# EAGLE schematic Bodenplatine (EAGLE 8.6.0)
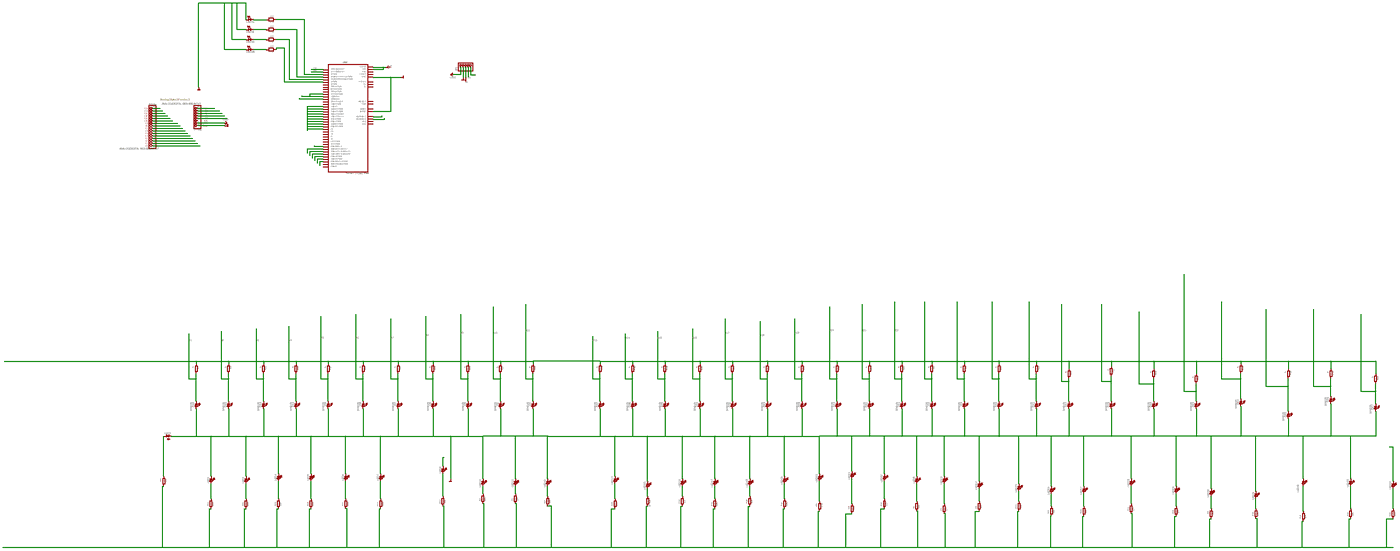
[diagram p0: schematic, sheet 1, overview]
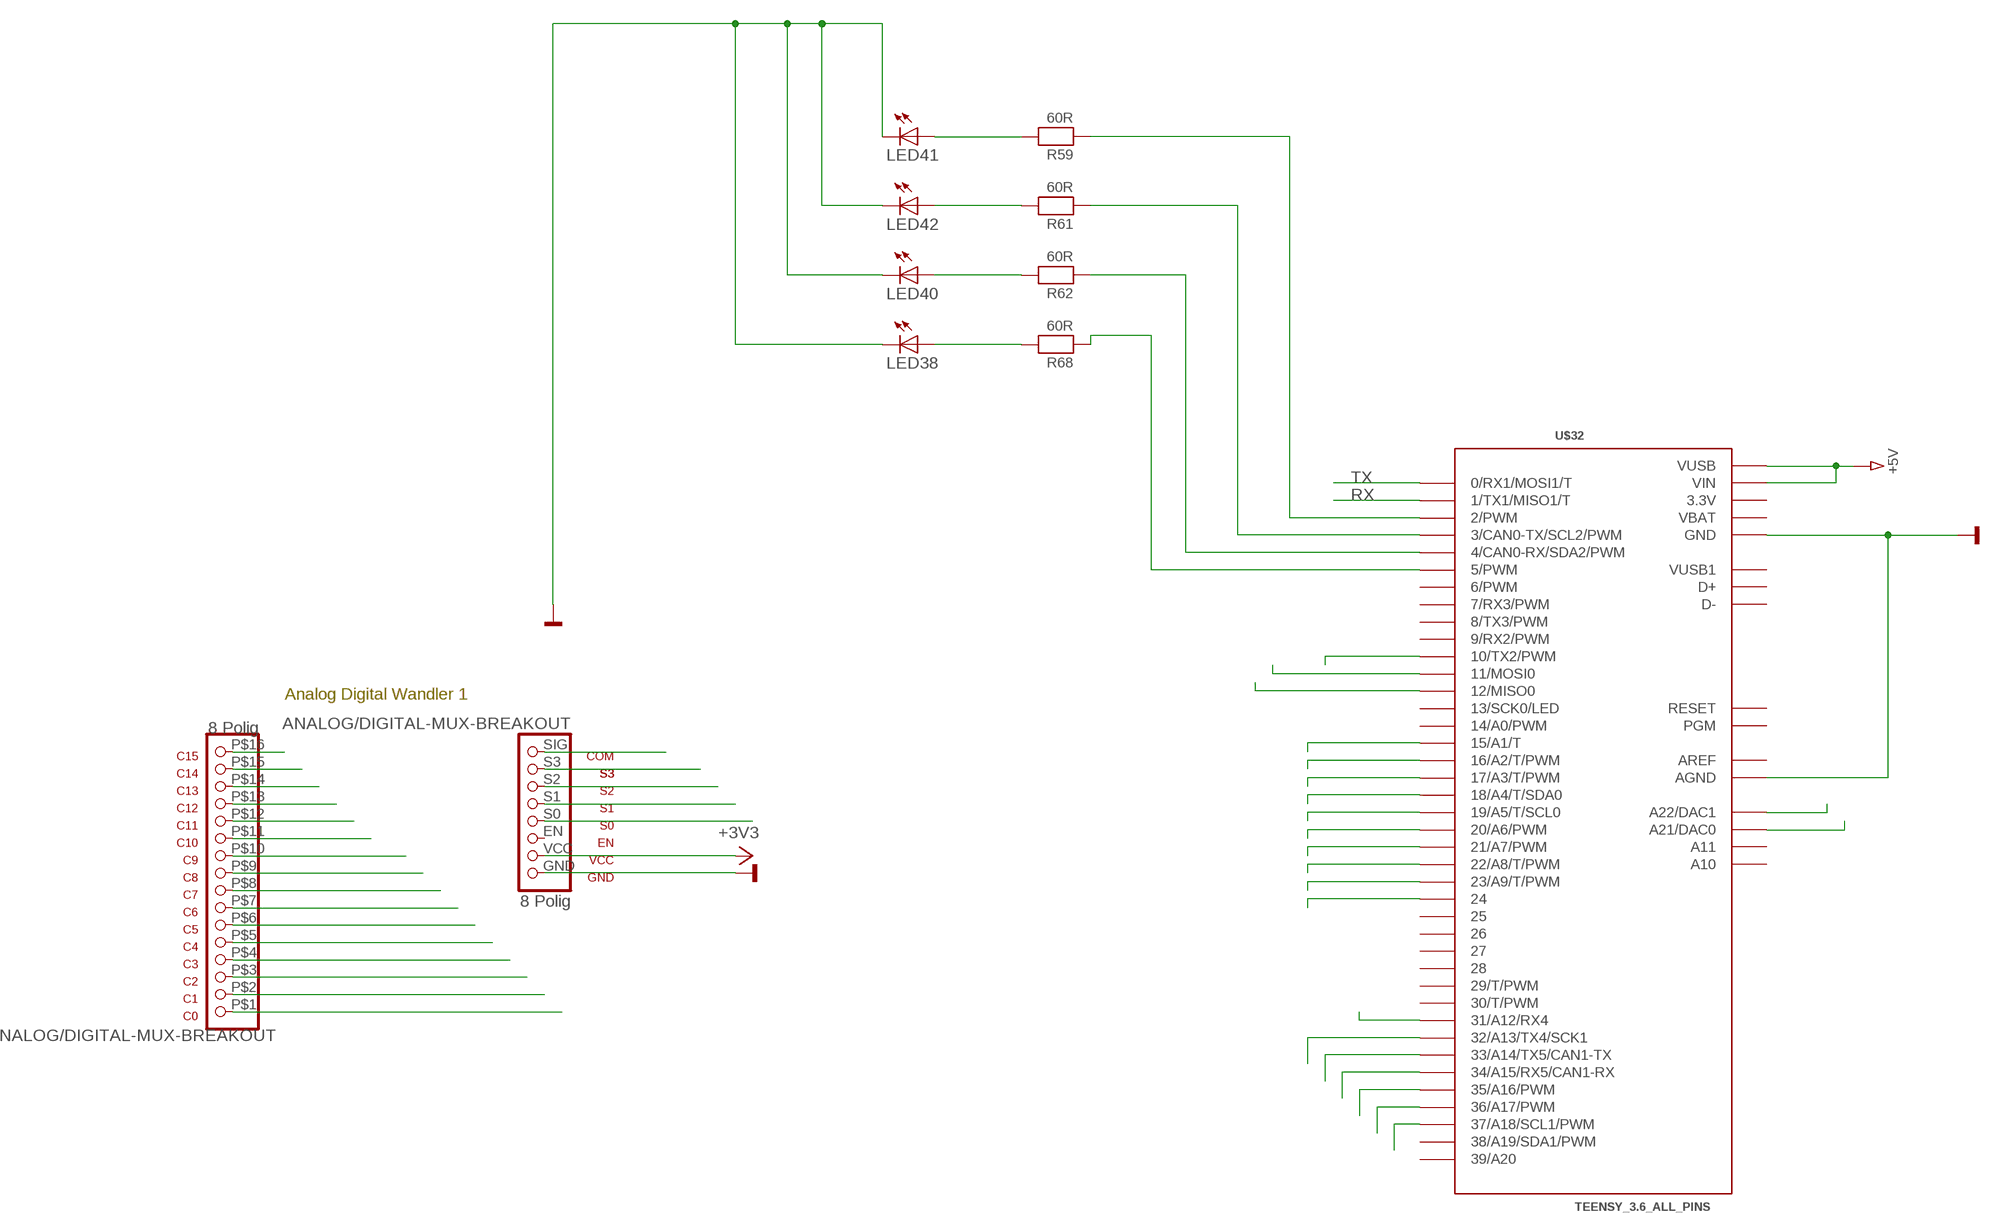
[diagram p1: schematic, sheet 1, part 1 of 6]
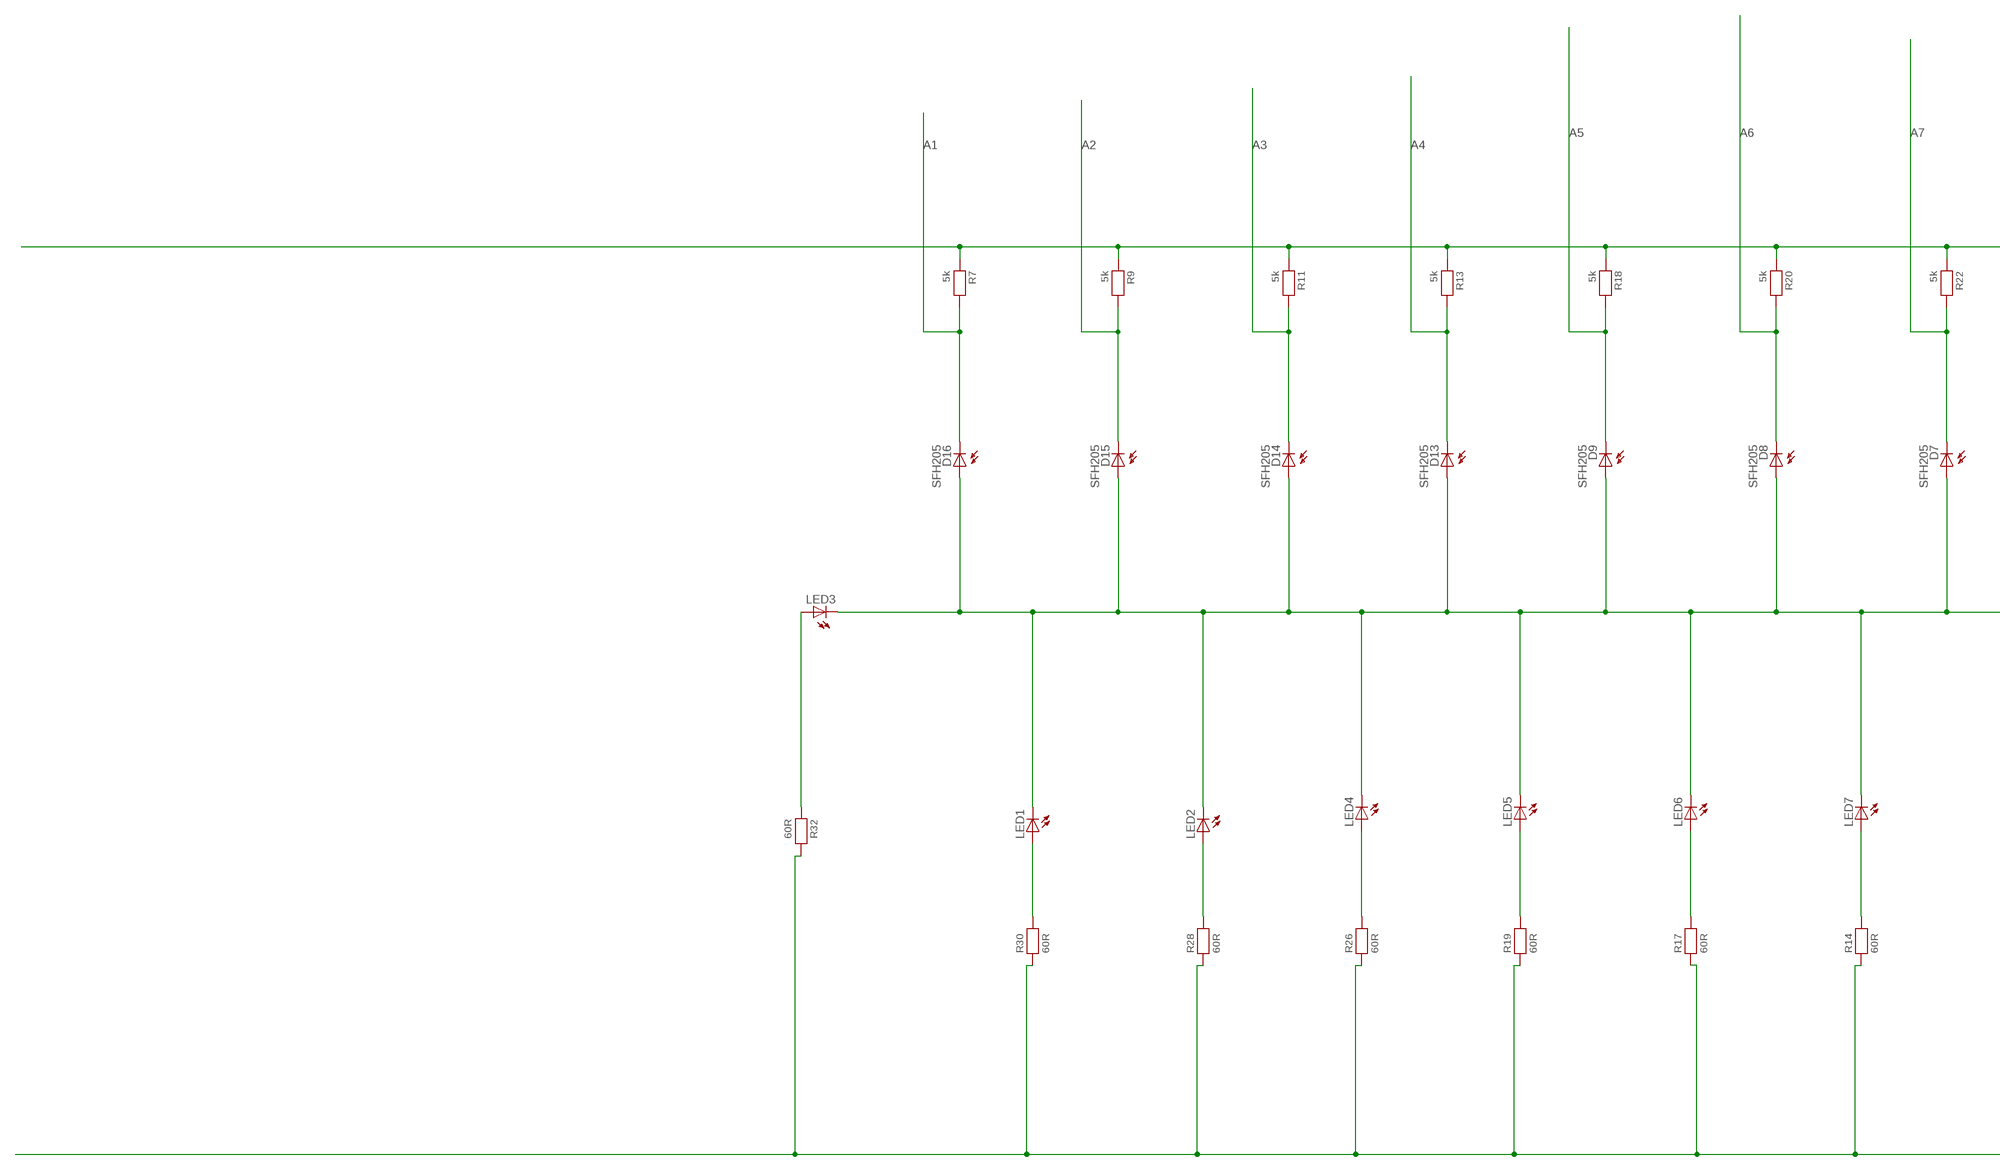
[diagram p2: schematic, sheet 1, part 2 of 6]
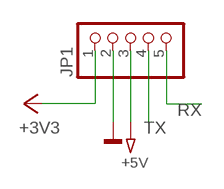
[diagram p3: schematic, sheet 1, part 3 of 6]
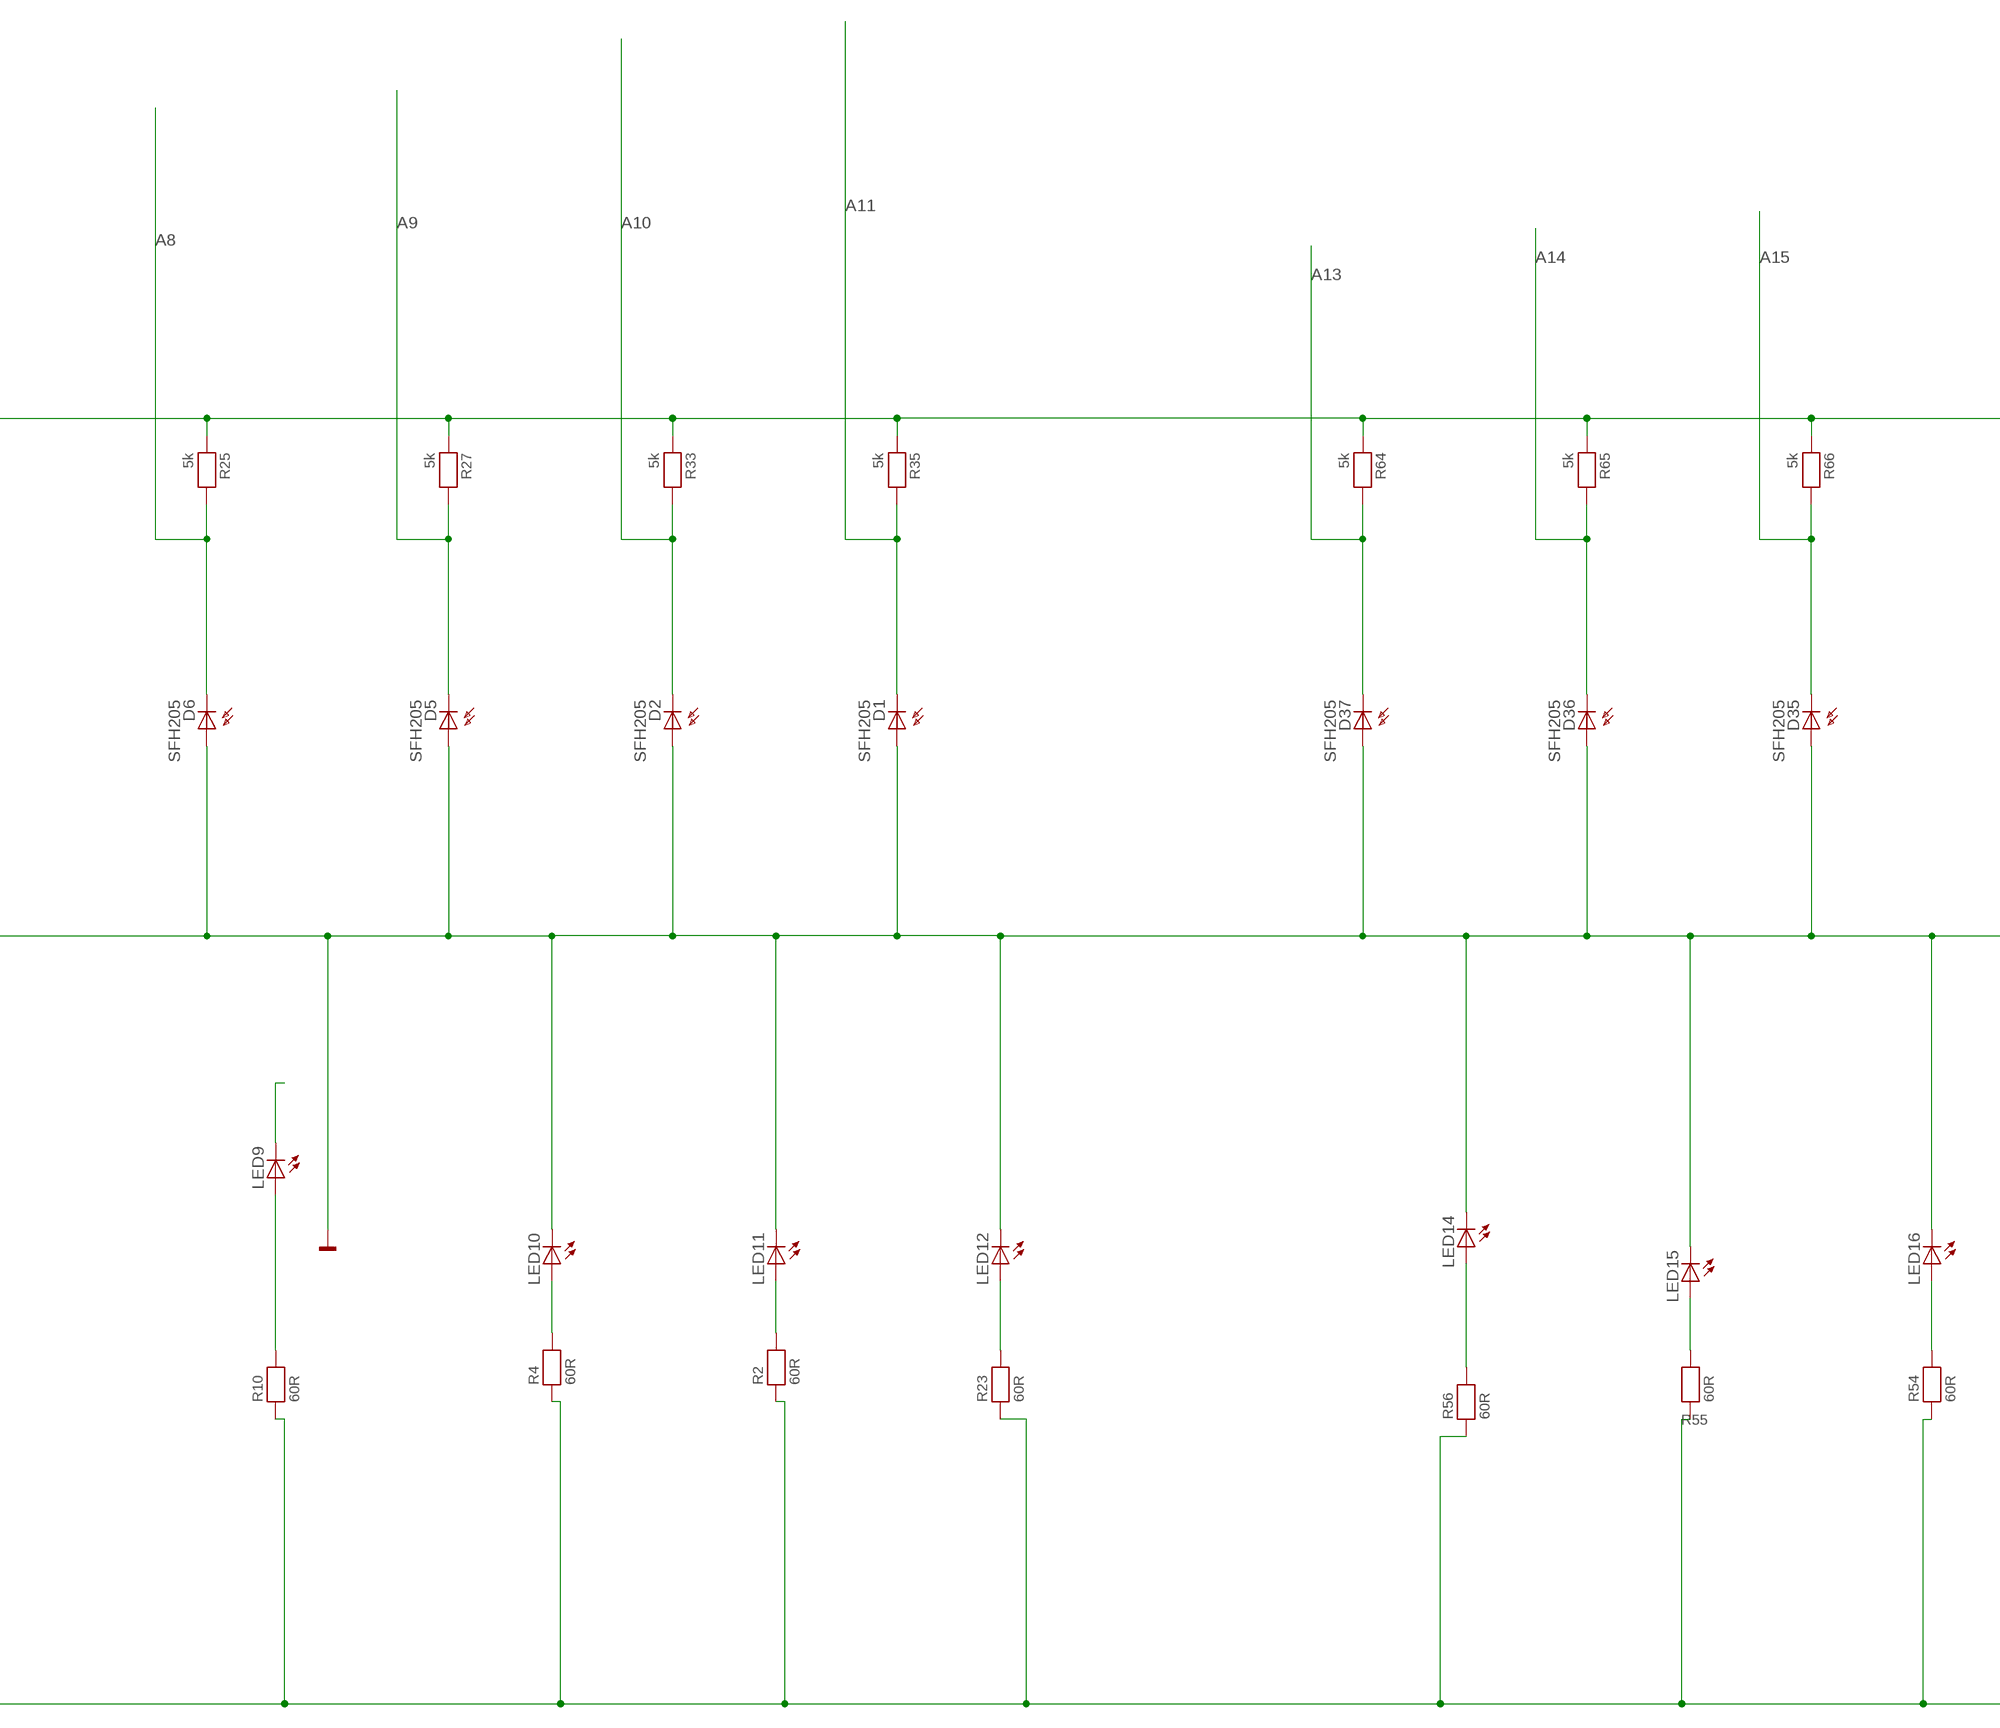
[diagram p4: schematic, sheet 1, part 4 of 6]
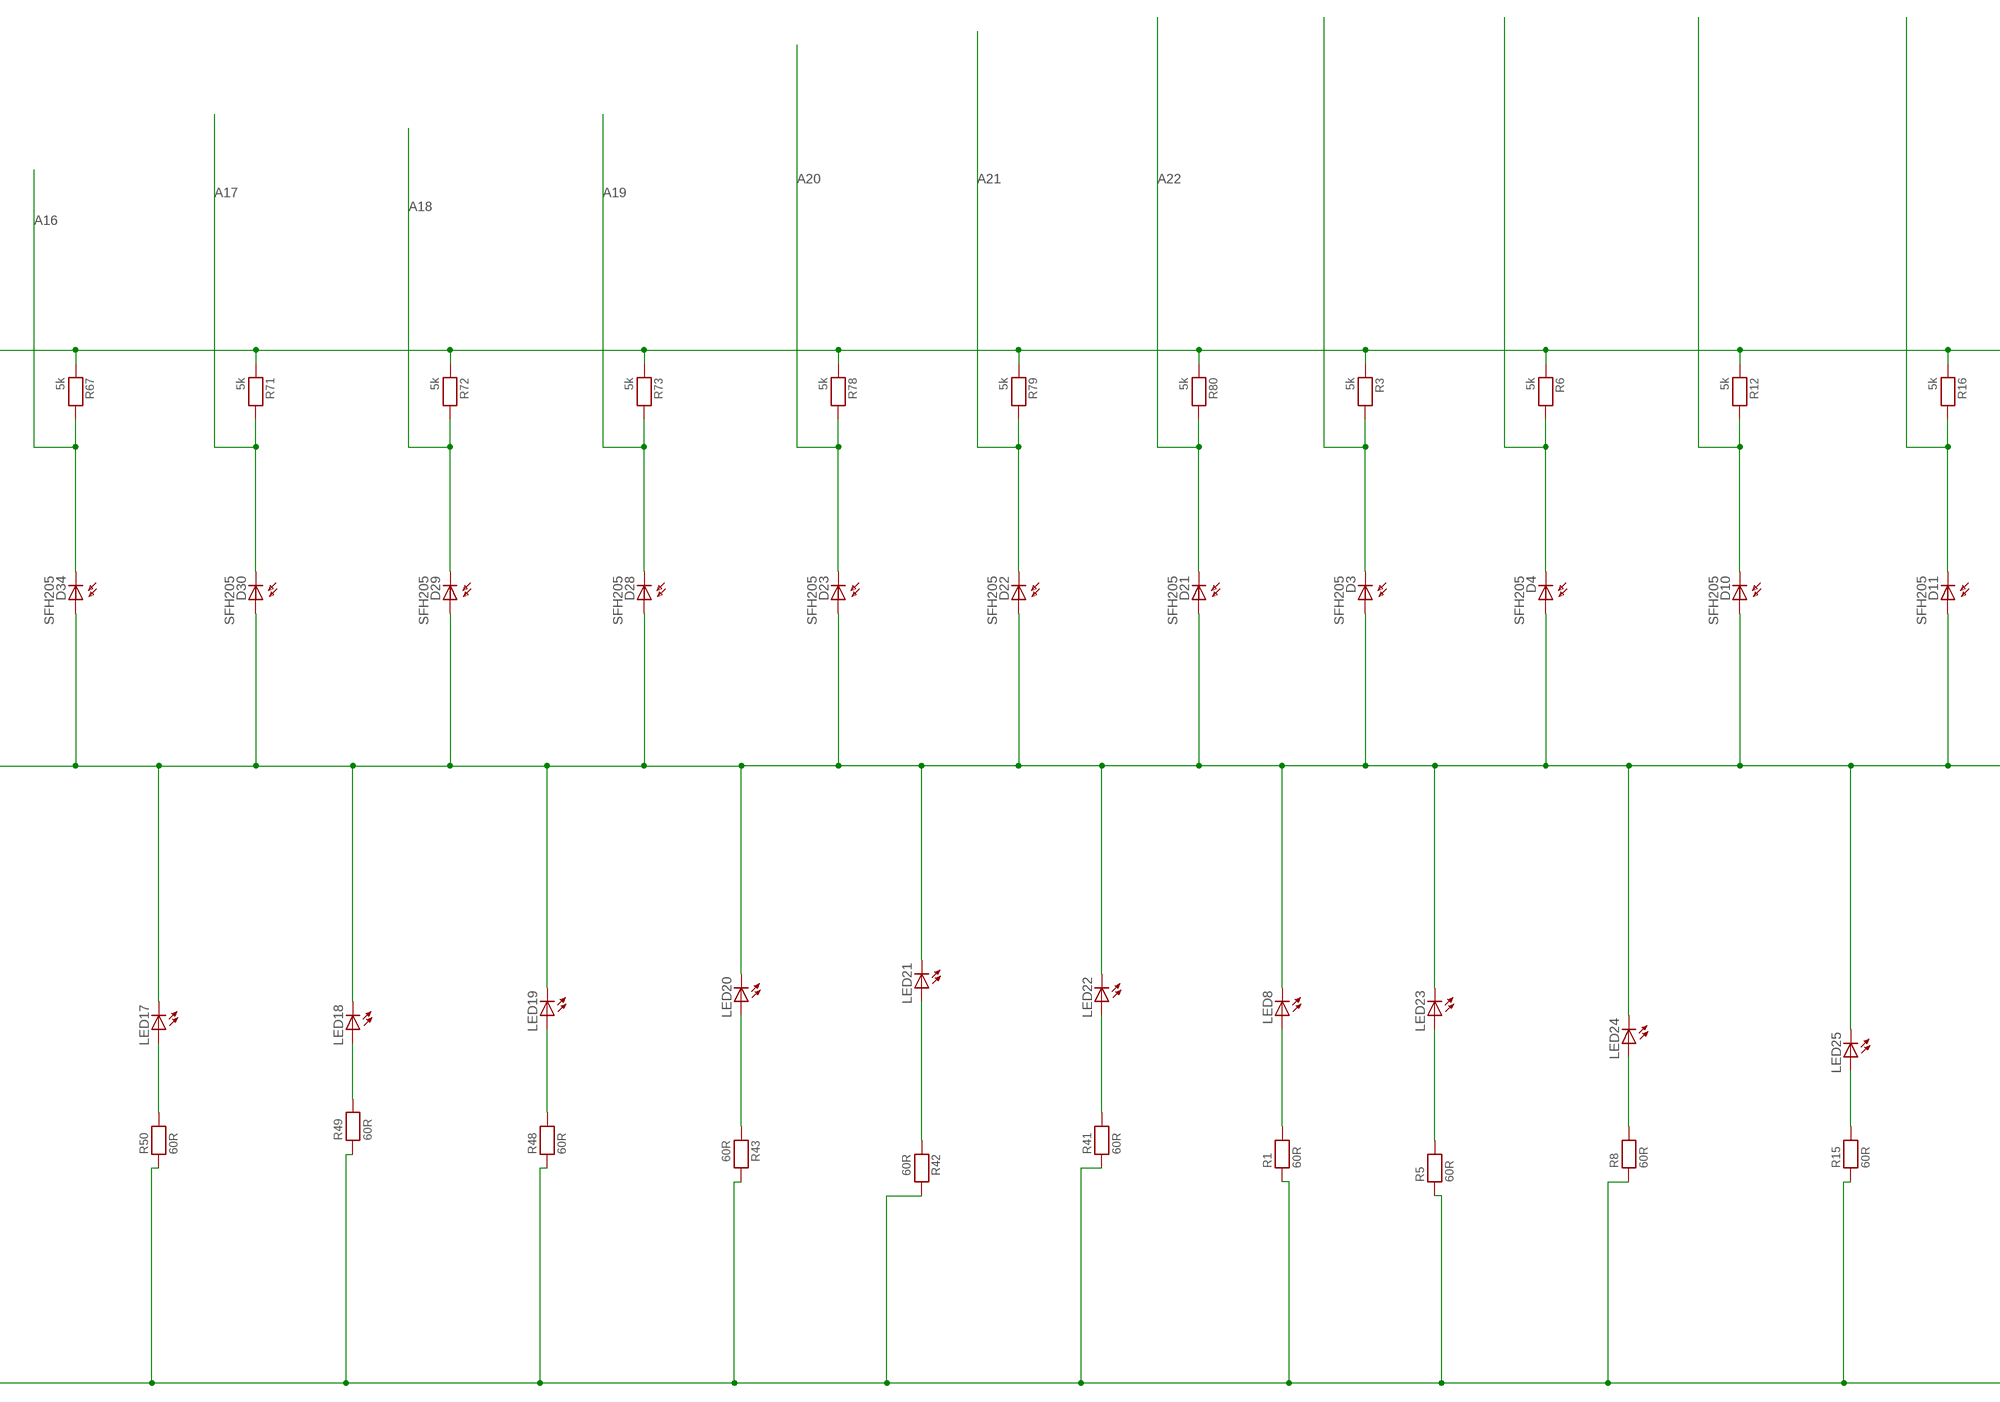
[diagram p5: schematic, sheet 1, part 5 of 6]
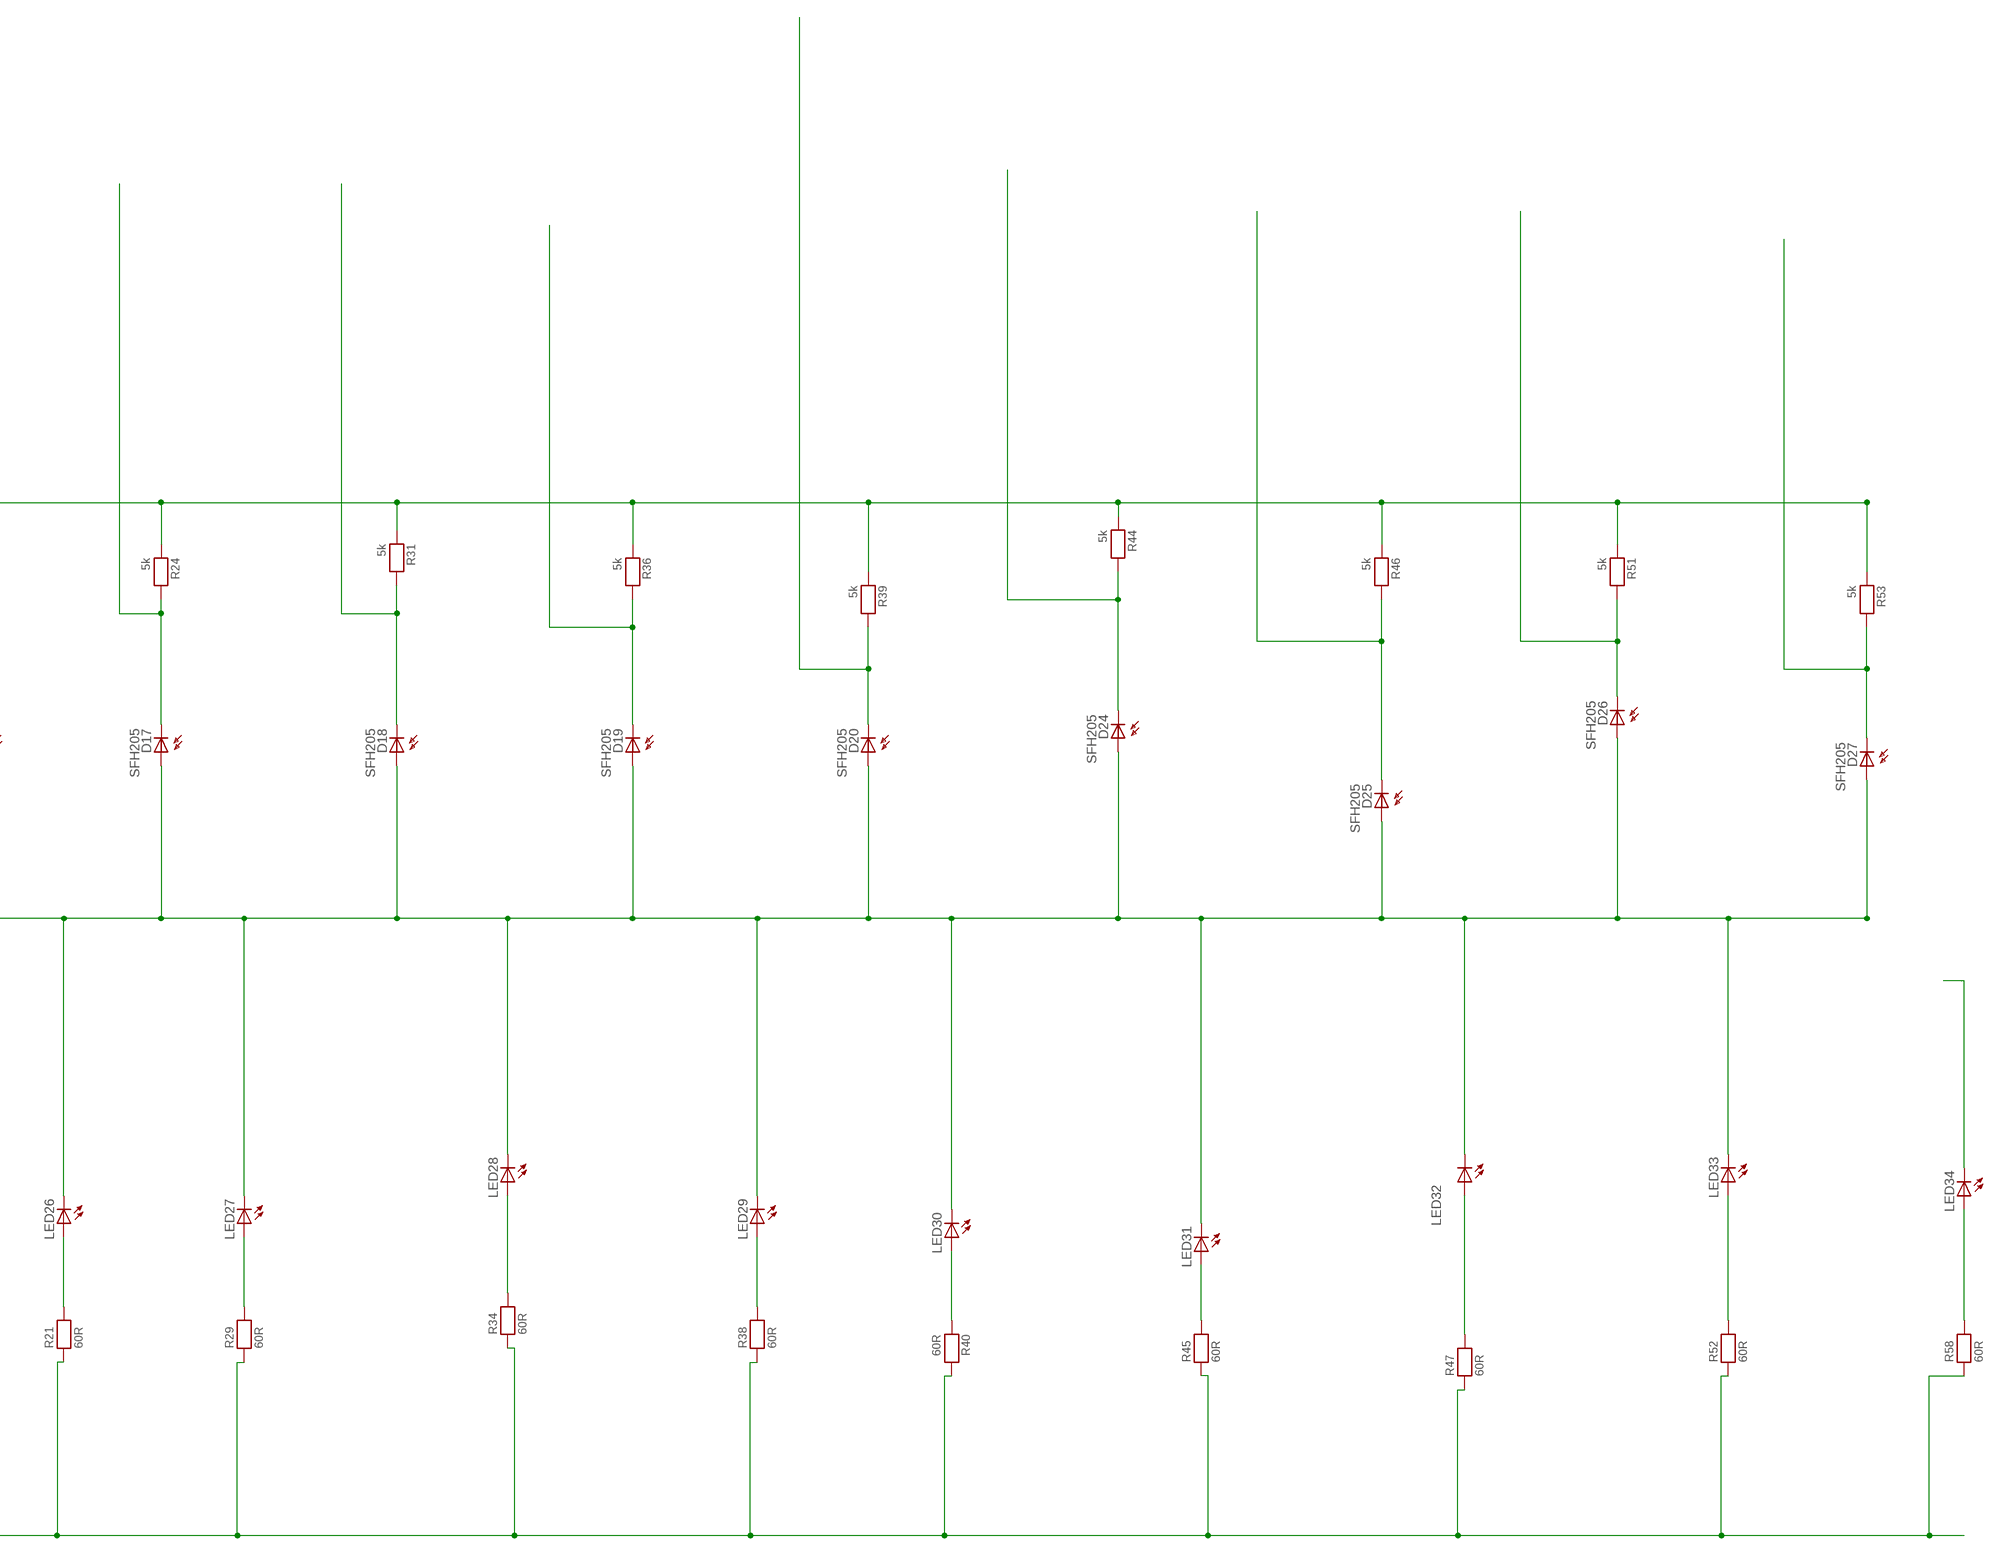
[diagram p6: schematic, sheet 1, part 6 of 6]

## Parts
D1  SFH205  [SFH205]
D2  SFH205  [SFH205]
D3  SFH205  [SFH205]
D4  SFH205  [SFH205]
D5  SFH205  [SFH205]
D6  SFH205  [SFH205]
D7  SFH205  [SFH205]
D8  SFH205  [SFH205]
D9  SFH205  [SFH205]
D10  SFH205  [SFH205]
D11  SFH205  [SFH205]
D13  SFH205  [SFH205]
D14  SFH205  [SFH205]
D15  SFH205  [SFH205]
D16  SFH205  [SFH205]
D17  SFH205  [SFH205]
D18  SFH205  [SFH205]
D19  SFH205  [SFH205]
D20  SFH205  [SFH205]
D21  SFH205  [SFH205]
D22  SFH205  [SFH205]
D23  SFH205  [SFH205]
D24  SFH205  [SFH205]
D25  SFH205  [SFH205]
D26  SFH205  [SFH205]
D27  SFH205  [SFH205]
D28  SFH205  [SFH205]
D29  SFH205  [SFH205]
D30  SFH205  [SFH205]
D34  SFH205  [SFH205]
D35  SFH205  [SFH205]
D36  SFH205  [SFH205]
D37  SFH205  [SFH205]
JP1  PINHD-1X5  [1X05]
LED1  LED3MM  [LED3MM]
LED2  LED3MM  [LED3MM]
LED3  LED3MM  [LED3MM]
LED4  LED3MM  [LED3MM]
LED5  LED3MM  [LED3MM]
LED6  LED3MM  [LED3MM]
LED7  LED3MM  [LED3MM]
LED8  LED3MM  [LED3MM]
LED9  LED3MM  [LED3MM]
LED10  LED3MM  [LED3MM]
LED11  LED3MM  [LED3MM]
LED12  LED3MM  [LED3MM]
LED14  LED3MM  [LED3MM]
LED15  LED3MM  [LED3MM]
LED16  LED3MM  [LED3MM]
LED17  LED3MM  [LED3MM]
LED18  LED3MM  [LED3MM]
LED19  LED3MM  [LED3MM]
LED20  LED3MM  [LED3MM]
LED21  LED3MM  [LED3MM]
LED22  LED3MM  [LED3MM]
LED23  LED3MM  [LED3MM]
LED24  LED3MM  [LED3MM]
LED25  LED3MM  [LED3MM]
LED26  LED3MM  [LED3MM]
LED27  LED3MM  [LED3MM]
LED28  LED3MM  [LED3MM]
LED29  LED3MM  [LED3MM]
LED30  LED3MM  [LED3MM]
LED31  LED3MM  [LED3MM]
LED32  LED3MM  [LED3MM]
LED33  LED3MM  [LED3MM]
LED34  LED3MM  [LED3MM]
LED38  LED3MM  [LED3MM]
LED40  LED3MM  [LED3MM]
LED41  LED3MM  [LED3MM]
LED42  LED3MM  [LED3MM]
R1  60R  R1206  [1206]
R2  60R  R1206  [1206]
R3  5k  R1206  [1206]
R4  60R  R1206  [1206]
R5  60R  R1206  [1206]
R6  5k  R1206  [1206]
R7  5k  R1206  [1206]
R8  60R  R1206  [1206]
R9  5k  R1206  [1206]
R10  60R  R1206  [1206]
R11  5k  R1206  [1206]
R12  5k  R1206  [1206]
R13  5k  R1206  [1206]
R14  60R  R1206  [1206]
R15  60R  R1206  [1206]
R16  5k  R1206  [1206]
R17  60R  R1206  [1206]
R18  5k  R1206  [1206]
R19  60R  R1206  [1206]
R20  5k  R1206  [1206]
R21  60R  R1206  [1206]
R22  5k  R1206  [1206]
R23  60R  R1206  [1206]
R24  5k  R1206  [1206]
R25  5k  R1206  [1206]
R26  60R  R1206  [1206]
R27  5k  R1206  [1206]
R28  60R  R1206  [1206]
R29  60R  R1206  [1206]
R30  60R  R1206  [1206]
R31  5k  R1206  [1206]
R32  60R  R1206  [1206]
R33  5k  R1206  [1206]
R34  60R  R1206  [1206]
R35  5k  R1206  [1206]
R36  5k  R1206  [1206]
R38  60R  R1206  [1206]
R39  5k  R1206  [1206]
R40  60R  R1206  [1206]
R41  60R  R1206  [1206]
R42  60R  R1206  [1206]
R43  60R  R1206  [1206]
R44  5k  R1206  [1206]
R45  60R  R1206  [1206]
R46  5k  R1206  [1206]
R47  60R  R1206  [1206]
R48  60R  R1206  [1206]
R49  60R  R1206  [1206]
R50  60R  R1206  [1206]
R51  5k  R1206  [1206]
R52  60R  R1206  [1206]
R53  5k  R1206  [1206]
R54  60R  R1206  [1206]
R55  60R  R1206  [1206]
R56  60R  R1206  [1206]
R58  60R  R1206  [1206]
R59  60R  R1206  [1206]
R61  60R  R1206  [1206]
R62  60R  R1206  [1206]
R64  5k  R1206  [1206]
R65  5k  R1206  [1206]
R66  5k  R1206  [1206]
R67  5k  R1206  [1206]
R68  60R  R1206  [1206]
R71  5k  R1206  [1206]
R72  5k  R1206  [1206]
R73  5k  R1206  [1206]
R78  5k  R1206  [1206]
R79  5k  R1206  [1206]
R80  5k  R1206  [1206]
U$32  TEENSY_3.6_ALL_PINS  [TEENSY_3.6_ALL_PINS]
X1  ANALOG/DIGITAL-MUX-BREAKOUT  [ANALOG/DIGITAL-MUX-BREAKOUT]

## Nets
+3V3: JP1.1 R3.1 R6.1 R7.1 R9.1 R11.1 R12.1 R13.1 R16.1 R18.1 R20.1 R22.1 R24.1 R25.1 R27.1 R31.1 R33.1 R35.1 R36.1 R39.1 R44.1 R46.1 R51.1 R53.1 R64.1 R65.1 R66.1 R67.1 R71.1 R72.1 R73.1 R78.1 R79.1 R80.1 X1.VCC
+5V: JP1.3 R1.1 R2.1 R4.1 R5.1 R8.1 R10.1 R14.1 R15.1 R17.1 R19.1 R21.1 R23.1 R26.1 R28.1 R29.1 R30.1 R32.2 R34.1 R38.1 R40.2 R41.1 R42.2 R43.2 R45.1 R47.1 R48.1 R49.1 R50.1 R52.1 R54.1 R55.1 R56.1 R58.1 U$32.VIN U$32.VUSB
A1: D16.K(C) R7.2 U$32.15/A1(15/A1/T)
A2: D15.K(C) R9.2 U$32.16/A2(16/A2/T/PWM)
A3: D14.K(C) R11.2 U$32.17/A3(17/A3/T/PWM)
A4: D13.K(C) R13.2 U$32.18/A4(18/A4/T/SDA0)
A5: D9.K(C) R18.2 U$32.19/A5(19/A5/T/SCL0)
A6: D8.K(C) R20.2 U$32.20/A6(20/A6/PWM)
A7: D7.K(C) R22.2 U$32.21/A7(21/A7/PWM)
A8: D6.K(C) R25.2 U$32.22/A8(22/A8/T/PWM)
A9: D5.K(C) R27.2 U$32.23/A9(23/A9/T/PWM)
A10: D2.K(C) R33.2 U$32.A21(A21/DAC0)
A11: D1.K(C) R35.2 U$32.A22(A22/DAC1)
A13: D37.K(C) R64.2 U$32.32/A13(32/A13/TX4/SCK1)
A14: D36.K(C) R65.2 U$32.33/A14(33/A14/TX5/CAN1-TX)
A15: D35.K(C) R66.2 U$32.34/A15(34/A15/RX5/CAN1-RX)
A16: D34.K(C) R67.2 U$32.35/A16(35/A16/PWM)
A17: D30.K(C) R71.2 U$32.36/A17(36/A17/PWM)
A18: D29.K(C) R72.2 U$32.37/A18(37/A18/SCL1/PWM)
A19: D28.K(C) R73.2 X1.P$1
A20: D23.K(C) R78.2 X1.P$2
A21: D22.K(C) R79.2 X1.P$3
A22: D21.K(C) R80.2 X1.P$4
A23: D3.K(C) R3.2 X1.P$5
A24: D4.K(C) R6.2 X1.P$6
A25: D10.K(C) R12.2 X1.P$7
A26: D11.K(C) R16.2 X1.P$8
A27: D17.K(C) R24.2 X1.P$9
A28: D18.K(C) R31.2 X1.P$10
A29: D19.K(C) R36.2 X1.P$11
A30: D20.K(C) R39.2 X1.P$12
A31: D24.K(C) R44.2 X1.P$13
A32: D25.K(C) R46.2 X1.P$14
A33: D26.K(C) R51.2 X1.P$15
A34: D27.K(C) R53.2 X1.P$16
GND: D1.A D2.A D3.A D4.A D5.A D6.A D7.A D8.A D9.A D10.A D11.A D13.A D14.A D15.A D16.A D17.A D18.A D19.A D20.A D21.A D22.A D23.A D24.A D25.A D26.A D27.A D28.A D29.A D30.A D34.A D35.A D36.A D37.A JP1.2 LED1.K(C) LED2.K(C) LED3.K(C) LED4.K(C) LED5.K(C) LED6.K(C) LED7.K(C) LED8.K(C) LED9.K(C) LED10.K(C) LED11.K(C) LED12.K(C) LED14.K(C) LED15.K(C) LED16.K(C) LED17.K(C) LED18.K(C) LED19.K(C) LED20.K(C) LED21.K(C) LED22.K(C) LED23.K(C) LED24.K(C) LED25.K(C) LED26.K(C) LED27.K(C) LED28.K(C) LED29.K(C) LED30.K(C) LED31.K(C) LED32.K(C) LED33.K(C) LED34.K(C) LED38.K(C) LED40.K(C) LED41.K(C) LED42.K(C) U$32.AGND U$32.GND U$32.GND1(GND) U$32.GND3(GND) U$32.GND4(GND) U$32.GND6(GND) X1.GND
N$1: LED8.A R1.2
N$2: LED11.A R2.2
N$3: LED23.A R5.2
N$4: LED10.A R4.2
N$5: LED24.A R8.2
N$6: LED25.A R15.2
N$7: LED26.A R21.2
N$8: LED27.A R29.2
N$9: LED28.A R34.2
N$10: LED9.A R10.2
N$11: LED29.A R38.2
N$12: LED30.A R40.1
N$13: LED12.A R23.2
N$14: LED31.A R45.2
N$15: LED32.A R47.2
N$16: LED7.A R14.2
N$17: LED33.A R52.2
N$18: LED6.A R17.2
N$19: LED3.A R32.1
N$20: LED5.A R19.2
N$21: LED34.A R58.2
N$22: LED41.A R59.2
N$23: LED42.A R61.2
N$24: LED40.A R62.2
N$25: LED38.A R68.2
N$26: LED4.A R26.2
N$28: LED2.A R28.2
N$30: LED1.A R30.2
N$33: R68.1 U$32.5(5/PWM)
N$42: LED22.A R41.2
N$44: LED21.A R42.1
N$46: LED20.A R43.1
N$56: LED19.A R48.2
N$58: LED18.A R49.2
N$60: LED17.A R50.2
N$68: LED16.A R54.2
N$70: LED15.A R55.2
N$72: LED14.A R56.2
RIX2: R62.1 U$32.4(4/CAN0-RX/SDA2/PWM)
RIX3: R61.1 U$32.3(3/CAN0-TX/SCL2/PWM)
RIX4: R59.1 U$32.2(2/PWM)
RX: JP1.5 U$32.1(1/TX1/MISO1/T)
S_0: U$32.24 X1.S0
S_1: U$32.12(12/MISO0) X1.S1
S_2: U$32.11(11/MOSI0) X1.S2
S_3: U$32.10(10/TX2/PWM) X1.S3
SIG: U$32.31/A12(31/A12/RX4) X1.SIG(COM)
TX: JP1.4 U$32.0(0/RX1/MOSI1/T)
Unconnected: U$32.6(6/PWM) U$32.7(7/RX3/PWM) U$32.8(8/TX3/PWM) U$32.9(9/RX2/PWM) U$32.13(13/SCK0/LED) U$32.14/A0(14/A0/PWM) U$32.25 U$32.26 U$32.27 U$32.28 U$32.29(29/T/PWM) U$32.30(30/T/PWM) U$32.38/A19(38/A19/SDA1/PWM) U$32.39/A20 U$32.A10 U$32.A11 U$32.D+ U$32.D- U$32.PGM U$32.RESET X1.EN

## Notes on the sheet
- Analog Digital Wandler 1

## Power pins joined to a net without a drawn wire
3.3V: U$32.3.3V U$32.3.3V3(3.3V) U$32.3.3V4(3.3V)
AREF: U$32.AREF
VBAT: U$32.VBAT
VUSB1: U$32.VUSB1

## Library data of the parts
D1-D11 D13-D30 D34-D37 = opto-trans-siemens:SFH205: PHOTO DIODE; OC_FARNELL: unknown; OC_NEWARK: unknown
JP1 = pinhead:PINHD-1X5: PIN HEADER
LED1-LED12 LED14-LED34 LED38 LED40-LED42 = led:LED: LED OSRAM: - CHIPLED LG R971, LG N971, LY N971, LG Q971, LY Q971, LO R971, LY R971 LH N974, LH R974 LS Q976, LO Q976, LY Q976 LO Q996 - Hyper CHIPLED LW Q18S LB Q993, LB Q99A, LB R99A - SideLED LS A670, LO A670, LY A670, LG A670, LP A670 LB A673, LV A673, LT A673, LW A673 LH A674 LY A675 LS A676, LA A676, LO A676, LY A676, LW A676 LS A679, LY A679, LG A679 - Hyper Micro SIDELED® LS Y876, LA Y876, LO Y876, LY Y876 LT Y87S - SmartLED LW L88C, LW L88S LB L89C, LB L89S, LG L890 LS L89K, LO L89K, LY L89K LS L896, LA L896, LO L896, LY L896 - TOPLED LS T670, LO T670, LY T670, LG T670, LP T670 LSG T670, LSP T670, LSY T670, LOP T670, LYG T670 LG T671, LOG T671, LSG T671 LB T673, LV T673, LT T673, LW T673 LH T674 LS T676, LA T676, LO T676, LY T676, LB T676, LH T676, LSB T676, LW T676 LB T67C, LV T67C, LT T67C, LS T67K, LO T67K, LY T67K, LW E67C LS E67B, LA E67B, LO E67B, LY E67B, LB E67C, LV E67C, LT E67C LW T67C LS T679, LY T679, LG T679 LS T770, LO T770, LY T770, LG T770, LP T770 LB T773, LV T773, LT T773, LW T773 LH T774 LS E675, LA E675, LY E675, LS T675 LS T776, LA T776, LO T776, LY T776, LB T776 LHGB T686 LT T68C, LB T68C - Hyper Mini TOPLED® LB M676 - Mini TOPLED Santana® LG M470 LS M47K, LO M47K, LY M47K Source: http://www.osram.convergy.de LUXEON: - LUMILED® LXK2-PW12-R00, LXK2-PW12-S00, LXK2-PW14-U00, LXK2-PW14-V00 LXK2-PM12-R00, LXK2-PM12-S00, LXK2-PM14-U00 LXK2-PE12-Q00, LXK2-PE12-R00, LXK2-PE12-S00, LXK2-PE14-T00, LXK2-PE14-U00 LXK2-PB12-K00, LXK2-PB12-L00, LXK2-PB12-M00, LXK2-PB14-N00, LXK2-PB14-P00, LXK2-PB14-Q00 LXK2-PR12-L00, LXK2-PR12-M00, LXK2-PR14-Q00, LXK2-PR14-R00 LXK2-PD12-Q00, LXK2-PD12-R00, LXK2-PD12-S00 LXK2-PH12-R00, LXK2-PH12-S00 LXK2-PL12-P00, LXK2-PL12-Q00, LXK2-PL12-R00 Source: www.luxeon.com KINGBRIGHT: KA-3528ASYC Source: www.kingbright.com
R1-R36 R38-R56 R58 R59 R61 R62 R64-R68 R71-R73 R78-R80 = R:R1206
U$32 = Teensy_3_and_LC_Series_Boards_v1.4:TEENSY_3.6_ALL_PINS: All PIN version of the Teensy 3.6.
X1 = Analog-Digital:ANALOG/DIGITAL-MUX-BREAKOUT